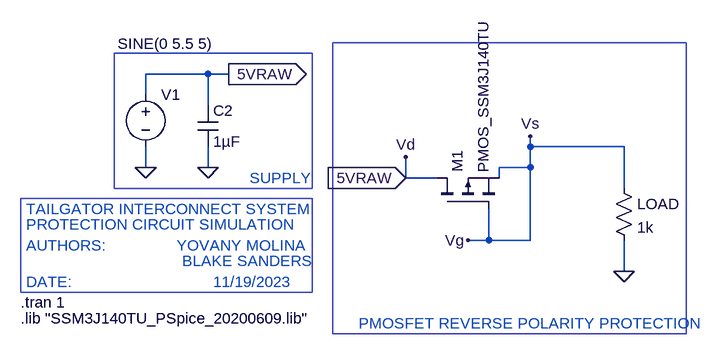
[diagram p0: schematic RPP.asc]
RPP.asc, the LTspice schematic file:
Version 4
SHEET 1 2500 1436
WIRE 1344 -80 1248 -80
WIRE 1376 -80 1344 -80
WIRE 1248 -48 1248 -80
WIRE 1344 -32 1344 -80
WIRE 1840 32 1840 16
WIRE 1984 32 1840 32
WIRE 1248 64 1248 32
WIRE 1344 64 1344 32
WIRE 1840 64 1840 32
WIRE 1840 64 1792 64
WIRE 1648 80 1648 48
WIRE 1696 80 1648 80
WIRE 1792 80 1792 64
WIRE 1984 96 1984 32
WIRE 1776 176 1776 128
WIRE 1776 176 1744 176
WIRE 1840 176 1840 64
WIRE 1840 176 1776 176
WIRE 1984 224 1984 176
FLAG 1744 176 Vg
FLAG 1840 16 Vs
FLAG 1648 48 Vd
FLAG 1248 64 0
FLAG 1376 -80 5VRAW
IOPIN 1376 -80 Out
FLAG 1648 80 5VRAW
IOPIN 1648 80 In
FLAG 1984 224 0
FLAG 1344 64 0
SYMBOL voltage 1248 -64 R0
WINDOW 3 -43 -63 Left 2
WINDOW 123 0 0 Left 0
WINDOW 39 0 0 Left 0
SYMATTR Value SINE(0 5.5 5)
SYMATTR InstName V1
SYMBOL res 1968 80 R0
SYMATTR InstName LOAD
SYMATTR Value 1k
SYMBOL cap 1328 -32 R0
SYMATTR InstName C2
SYMATTR Value 1µF
SYMBOL pmos 1696 128 R270
SYMATTR InstName M1
SYMATTR Value PMOS_SSM3J140TU
SYMATTR Prefix X
TEXT 1056 272 Left 2 !.tran 1
TEXT 1576 304 Left 2 ;PMOSFET REVERSE POLARITY PROTECTION
TEXT 1064 128 Left 2 ;TAILGATOR INTERCONNECT SYSTEM
TEXT 1064 152 Left 2 ;PROTECTION CIRCUIT SIMULATION
TEXT 1352 240 Left 2 ;11/19/2023
TEXT 1064 184 Left 2 ;AUTHORS:
TEXT 1296 184 Left 2 ;YOVANY MOLINA
TEXT 1304 208 Left 2 ;BLAKE SANDERS
TEXT 1064 240 Left 2 ;DATE:
TEXT 1408 80 Left 2 ;SUPPLY
TEXT 1056 296 Left 2 !.lib "SSM3J140TU_PSpice_20200609.lib"
RECTANGLE Normal 1504 112 1056 256
RECTANGLE Normal 1504 -112 1200 96
RECTANGLE Normal 2080 -128 1536 320

The netlist it stands for:
* RPP.asc
V1 5VRAW 0 SINE(0 5.5 5)
R§LOAD Vs 0 1k
C2 5VRAW 0 1µF
XM1 5VRAW Vs Vs PMOS_SSM3J140TU  ; pins D G S
.tran 1
* PMOSFET REVERSE POLARITY PROTECTION
* TAILGATOR INTERCONNECT SYSTEM
* PROTECTION CIRCUIT SIMULATION
* 11/19/2023
* AUTHORS:
* YOVANY MOLINA
* BLAKE SANDERS
* DATE:
* SUPPLY
.lib "SSM3J140TU_PSpice_20200609.lib"
.backanno
.end